# EAGLE design Signal_source_V1p0 (EAGLE 9.6.2)
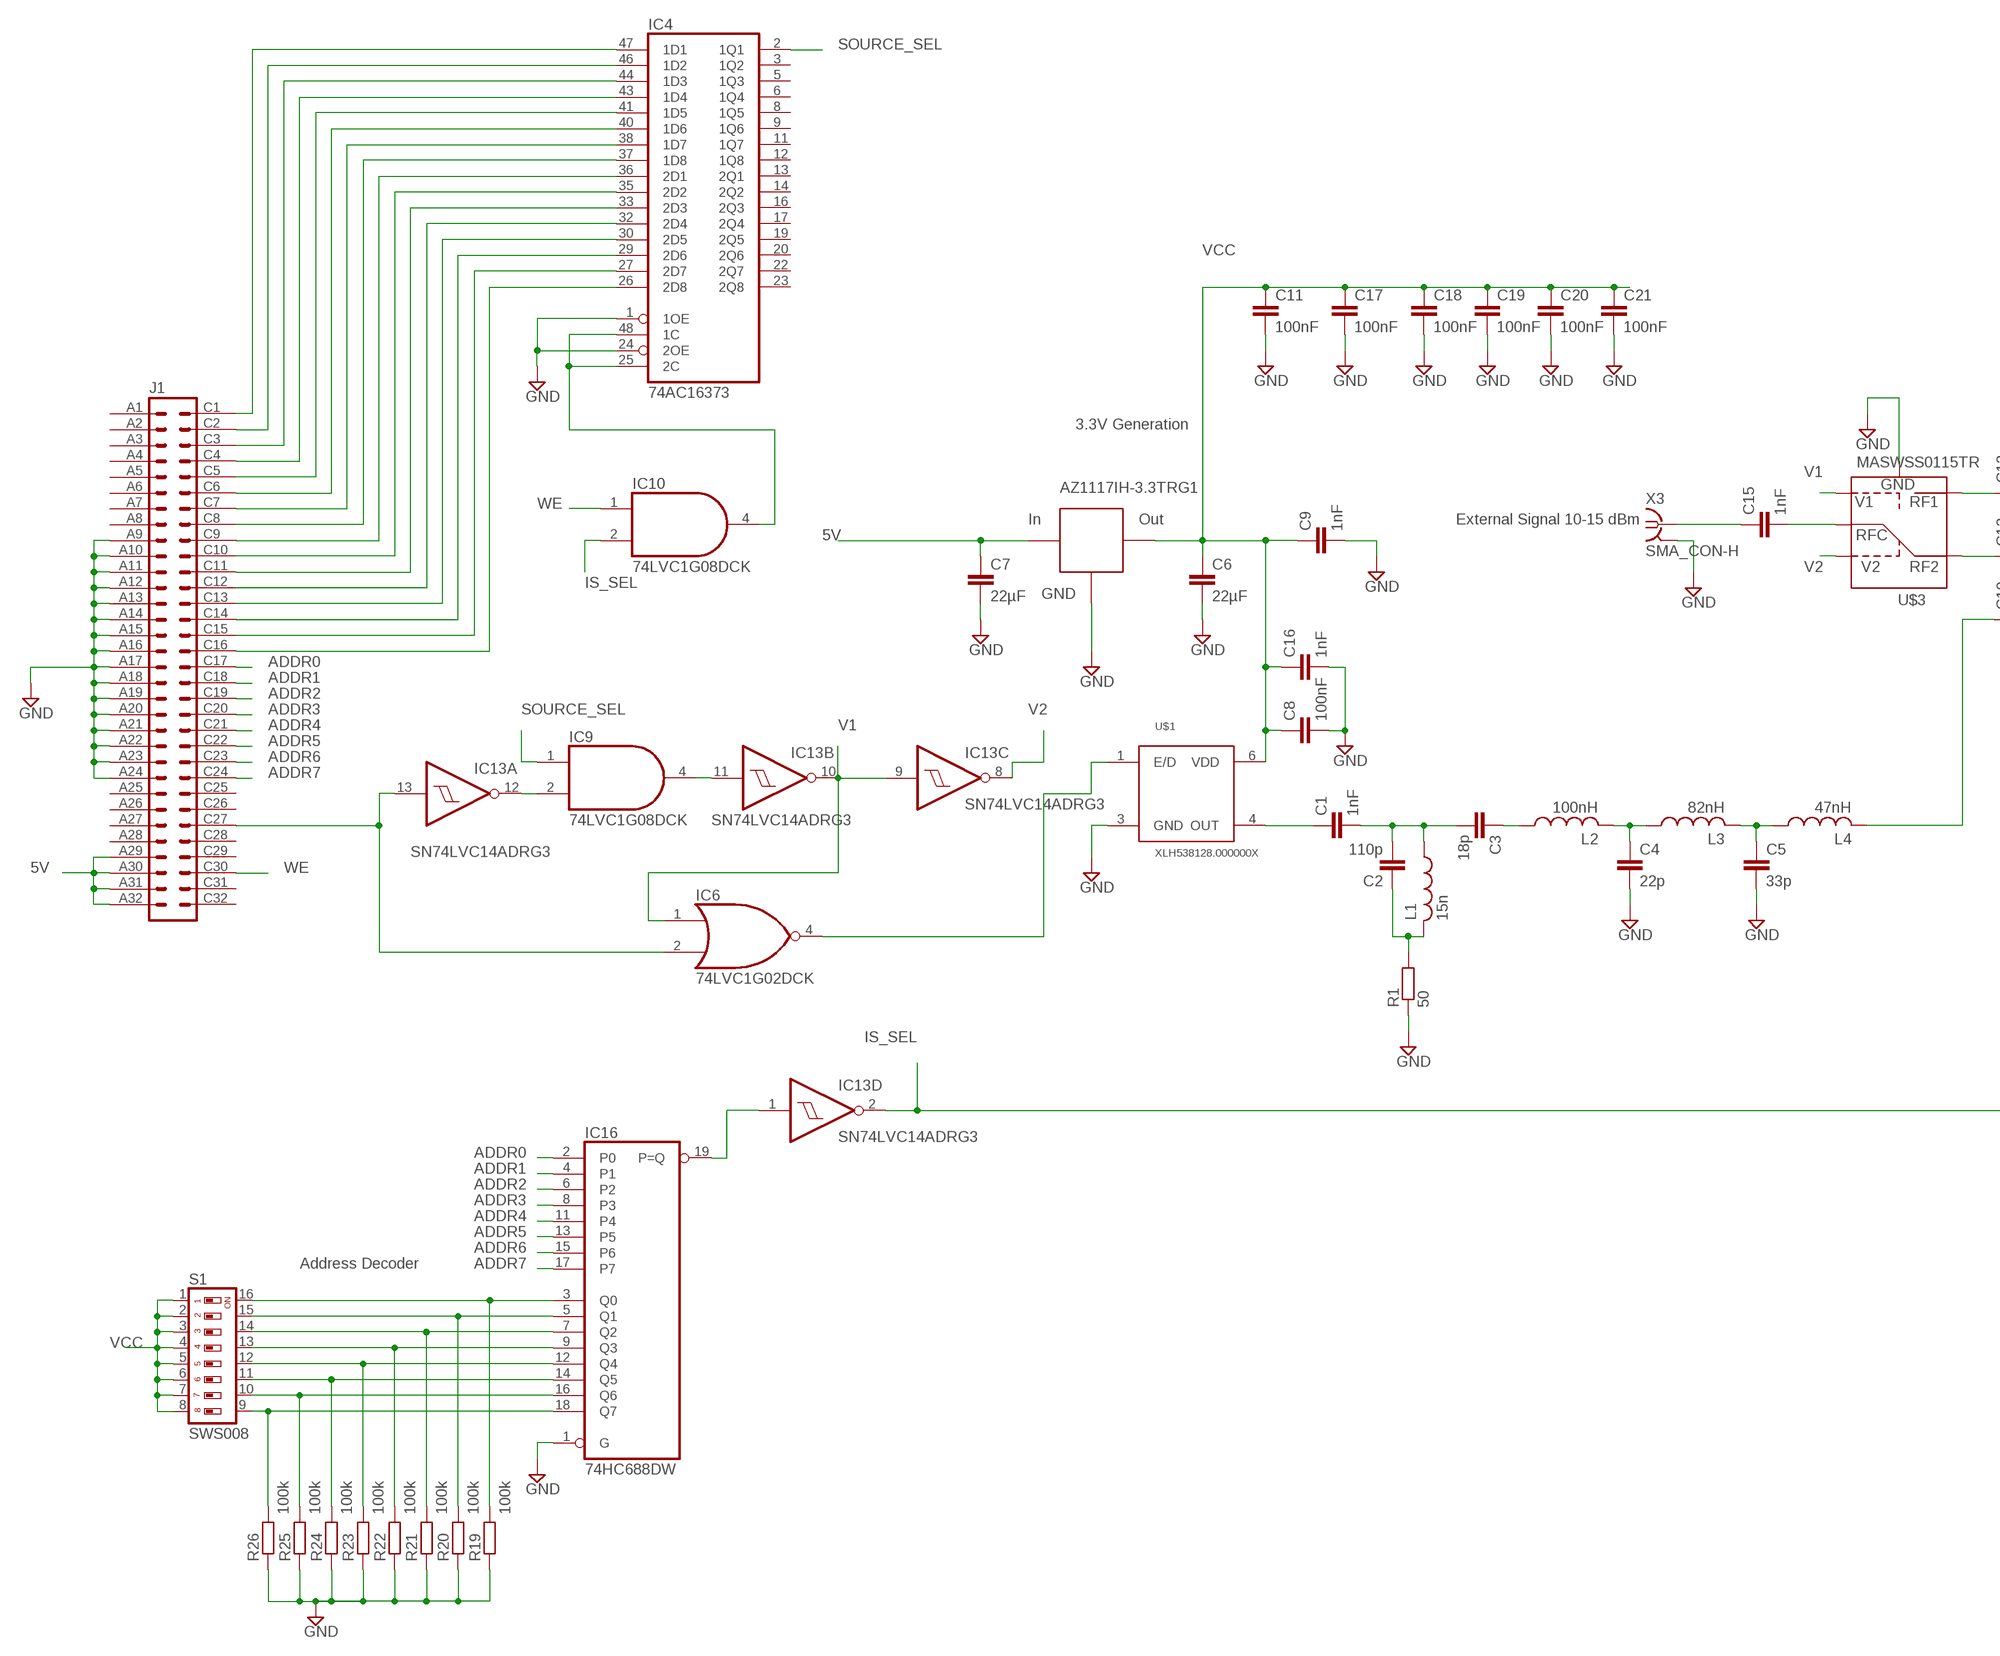
[diagram p0: schematic, sheet 1, part 1 of 2]
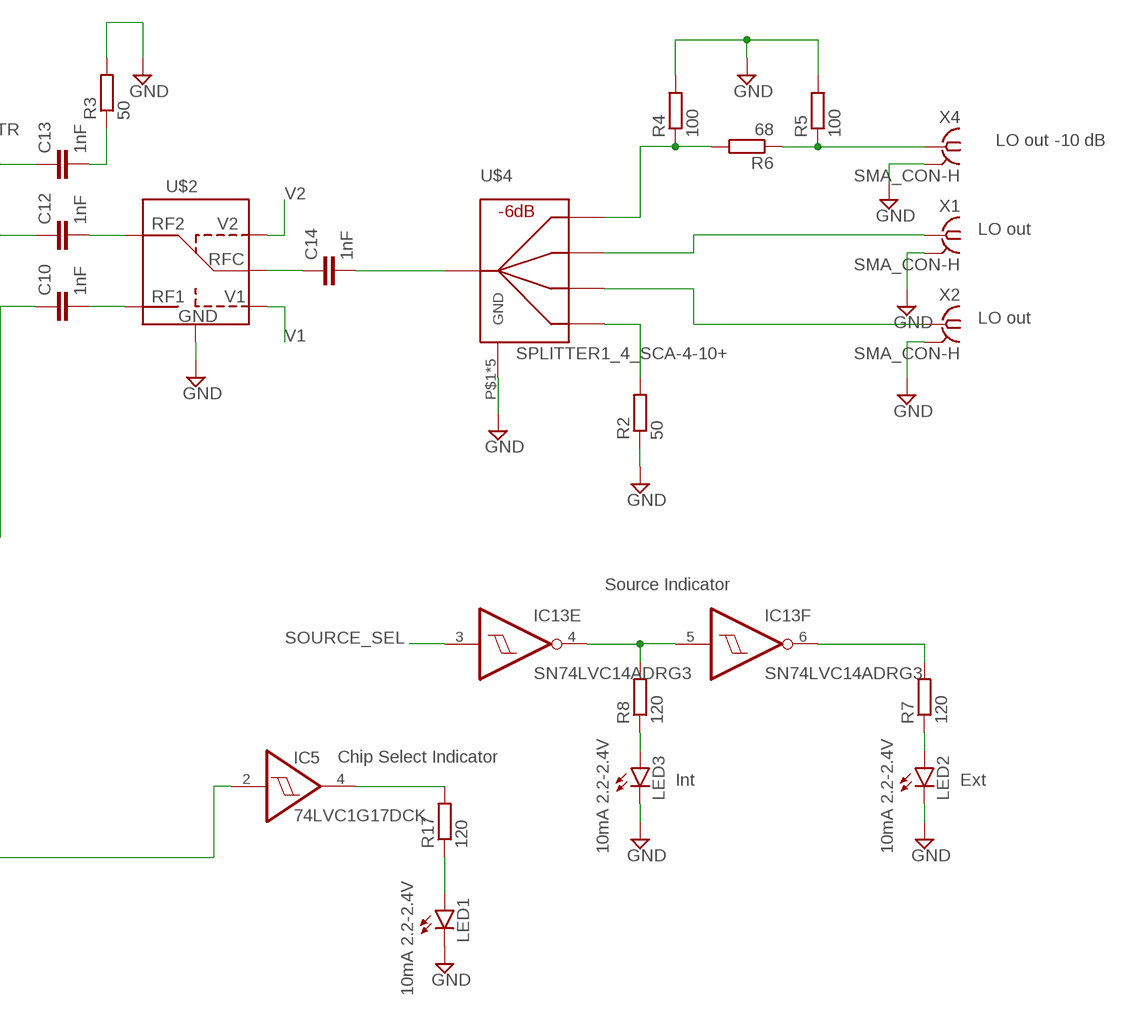
[diagram p1: schematic, sheet 1, part 2 of 2]

## Parts
C1  1nF  C-EUC0805  [C0805]
C2  110p  C-EUC0805  [C0805]
C3  18p  C-EUC0805  [C0805]
C4  22p  C-EUC0805  [C0805]
C5  33p  C-EUC0805  [C0805]
C6  22µF  C-EUC1206  [C1206]
C7  22µF  C-EUC1206  [C1206]
C8  100nF  C-EUC1206  [C1206]
C9  1nF  C-EUC0805  [C0805]
C10  1nF  C-EUC0805  [C0805]
C11  100nF  C-EUC1206  [C1206]
C12  1nF  C-EUC0805  [C0805]
C13  1nF  C-EUC0805  [C0805]
C14  1nF  C-EUC0805  [C0805]
C15  1nF  C-EUC0805  [C0805]
C16  1nF  C-EUC0805  [C0805]
C17  100nF  C-EUC1206  [C1206]
C18  100nF  C-EUC1206  [C1206]
C19  100nF  C-EUC1206  [C1206]
C20  100nF  C-EUC1206  [C1206]
C21  100nF  C-EUC1206  [C1206]
IC4  74AC16373  [SSOP48DL]
IC5  74LVC1G17DCK  [SC70-5]
IC6  74LVC1G02DCK  [SC70-5]
IC9  74LVC1G08DCK  [SC70-5]
IC10  74LVC1G08DCK  [SC70-5]
IC13  SN74LVC14ADRG3  7414D  [SO14]
IC16  74HC688DW  [SO20W]
J1  VG64P  [VG64P]
L1  15n  L-USL3225M  [L3225M]
L2  100nH  L-USL3225M  [L3225M]
L3  82nH  L-USL3225M  [L3225M]
L4  47nH  L-USL3225M  [L3225M]
LED1  10mA 2.2-2.4V  LED3MM  [LED3MM]
LED2  10mA 2.2-2.4V  LED3MM  [LED3MM]
LED3  10mA 2.2-2.4V  LED3MM  [LED3MM]
R1  50  R-EU_R0805  [R0805]
R2  50  R-EU_R0805  [R0805]
R3  50  R-EU_R0805  [R0805]
R4  100  R-EU_R0805  [R0805]
R5  100  R-EU_R0805  [R0805]
R6  68  R-EU_R0805  [R0805]
R7  120  R-EU_R0603  [R0603]
R8  120  R-EU_R0603  [R0603]
R17  120  R-EU_R0603  [R0603]
R19  100k  R-EU_R0603  [R0603]
R20  100k  R-EU_R0603  [R0603]
R21  100k  R-EU_R0603  [R0603]
R22  100k  R-EU_R0603  [R0603]
R23  100k  R-EU_R0603  [R0603]
R24  100k  R-EU_R0603  [R0603]
R25  100k  R-EU_R0603  [R0603]
R26  100k  R-EU_R0603  [R0603]
S1  SWS008  [SMS-008]
U$1  XLH538128.000000X  [5.0X3.2_XO]
U$2  MASWSS0115TR  SPDT_SC70-6  [SC70-6]
U$3  MASWSS0115TR  SPDT_SC70-6  [SC70-6]
U$4  SPLITTER1_4_SCA-4-10+  [SCA-4-10+]
U$9  AZ1117IH-3.3TRG1  LT1117  [SOT223]
X1  SMA_CON-H  [BU-SMA-H]
X2  SMA_CON-H  [BU-SMA-H]
X3  SMA_CON-H  [BU-SMA-H]
X4  SMA_CON-H  [BU-SMA-H]

## Nets
5V: C7.1 J1.A29 J1.A30 J1.A31 J1.A32 U$9.3(IN)
ADDR0: IC16.2(P0) J1.C17
ADDR1: IC16.4(P1) J1.C18
ADDR2: IC16.6(P2) J1.C19
ADDR3: IC16.8(P3) J1.C20
ADDR4: IC16.11(P4) J1.C21
ADDR5: IC16.13(P5) J1.C22
ADDR6: IC16.15(P6) J1.C23
ADDR7: IC16.17(P7) J1.C24
CLK_128: C1.1 U$1.4(OUT)
GND: C4.2 C5.2 C6.2 C7.2 C8.2 C9.2 C11.2 C16.2 C17.2 C18.2 C19.2 C20.2 C21.2 IC4.1(1OE) IC4.24(2OE) IC16.1(G) J1.A9 J1.A10 J1.A11 J1.A12 J1.A13 J1.A14 J1.A15 J1.A16 J1.A17 J1.A18 J1.A19 J1.A20 J1.A21 J1.A22 J1.A23 J1.A24 LED1.K(C) LED2.K(C) LED3.K(C) R1.1 R2.1 R3.2 R4.2 R5.2 R19.1 R20.1 R21.1 R22.1 R23.1 R24.1 R25.1 R26.1 U$1.3(GND) U$2.2(GND) U$3.2(GND) U$4.P$1(GND) U$4.P$2(GND) U$4.P$4(GND) U$4.P$5(GND) U$4.P$8(GND) U$9.1(GND) X1.2(GND) X1.3(GND) X1.4(GND) X1.5(GND) X2.2(GND) X2.3(GND) X2.4(GND) X2.5(GND) X3.2(GND) X3.3(GND) X3.4(GND) X3.5(GND) X4.2(GND) X4.3(GND) X4.4(GND) X4.5(GND)
IS_SEL: IC5.2(I) IC10.2(I1) IC13.2(D:O)
N$1: IC4.47(1D1) J1.C1
N$2 [RF_routing]: C1.2 C2.2 C3.2 L1.1
N$3 [RF_routing]: C2.1 L1.2 R1.2
N$4 [RF_routing]: C3.1 L2.1
N$5 [RF_routing]: C4.1 L2.2 L3.1
N$6 [RF_routing]: C5.1 L3.2 L4.1
N$7: IC4.46(1D2) J1.C2
N$8: IC4.44(1D3) J1.C3
N$9 [RF_routing]: C10.1 L4.2
N$10: IC4.43(1D4) J1.C4
N$11: IC4.41(1D5) J1.C5
N$12: IC4.40(1D6) J1.C6
N$13 [RF_routing]: C10.2 U$2.1(RF1)
N$14: IC4.38(1D7) J1.C7
N$15: IC4.37(1D8) J1.C8
N$16 [RF_routing]: C12.1 U$3.3(RF2)
N$17 [RF_routing]: C12.2 U$2.3(RF2)
N$18 [RF_routing]: C13.1 U$3.1(RF1)
N$19 [RF_routing]: C13.2 R3.1
N$20 [RF_routing]: C15.2 U$3.5(RFC)
N$21 [RF_routing]: C14.1 U$2.5(RFC)
N$22: C14.2 U$4.P$3
N$23 [RF_routing]: C15.1 X3.1
N$24: IC9.2(I1) IC13.12(A:O)
N$25: IC4.36(2D1) J1.C9
N$26: IC4.35(2D2) J1.C10
N$27: IC4.33(2D3) J1.C11
N$28: IC4.32(2D4) J1.C12
N$29: IC4.30(2D5) J1.C13
N$30: IC4.29(2D6) J1.C14
N$31: IC4.27(2D7) J1.C15
N$32: IC4.26(2D8) J1.C16
N$33: IC6.4(O) U$1.1(E/D)
N$34: IC6.2(I1) IC13.13(A:I) J1.C27
N$35: IC9.4(O) IC13.11(B:I)
N$36: IC4.25(2C) IC4.48(1C) IC10.4(O)
N$37: U$4.P$7 X1.1
N$38: U$4.P$9 X2.1
N$39: R2.2 U$4.P$10
N$40: IC16.3(Q0) R19.2 S1.16
N$41: R4.1 R6.2 U$4.P$6
N$42: R5.1 R6.1 X4.1
N$43: IC13.4(E:O) IC13.5(F:I) R8.2
N$44: IC13.6(F:O) R7.2
N$45: LED3.A R8.1
N$46: LED2.A R7.1
N$64: IC16.5(Q1) R20.2 S1.15
N$65: IC16.7(Q2) R21.2 S1.14
N$66: IC16.9(Q3) R22.2 S1.13
N$67: IC16.12(Q4) R23.2 S1.12
N$68: IC16.14(Q5) R24.2 S1.11
N$69: IC16.16(Q6) R25.2 S1.10
N$70: IC16.18(Q7) R26.2 S1.9
N$80: IC13.1(D:I) IC16.19(P=Q)
N$88: LED1.A R17.1
N$89: IC5.4(O) R17.2
SOURCE_SEL: IC4.2(1Q1) IC9.1(I0) IC13.3(E:I)
V1: IC6.1(I0) IC13.9(C:I) IC13.10(B:O) U$2.6(V1) U$3.6(V1)
V2: IC13.8(C:O) U$2.4(V2) U$3.4(V2)
VCC [3.3V]: C6.1 C8.1 C9.1 C11.1 C16.1 C17.1 C18.1 C19.1 C20.1 C21.1 S1.1 S1.2 S1.3 S1.4 S1.5 S1.6 S1.7 S1.8 U$1.6(VDD) U$9.2(OUT) U$9.4(OUT)
WE: IC10.1(I0) J1.C30
Unconnected: IC4.3(1Q2) IC4.5(1Q3) IC4.6(1Q4) IC4.8(1Q5) IC4.9(1Q6) IC4.11(1Q7) IC4.12(1Q8) IC4.13(2Q1) IC4.14(2Q2) IC4.16(2Q3) IC4.17(2Q4) IC4.19(2Q5) IC4.20(2Q6) IC4.22(2Q7) IC4.23(2Q8) J1.A1 J1.A2 J1.A3 J1.A4 J1.A5 J1.A6 J1.A7 J1.A8 J1.A25 J1.A26 J1.A27 J1.A28 J1.C25 J1.C26 J1.C28 J1.C29 J1.C31 J1.C32

## Notes on the sheet
- 3.3V Generation
- LO out -10 dB
- External Signal 10-15 dBm
- LO out
- LO out
- Source Indicator
- Chip Select Indicator
- Int | Ext
- Address Decoder

## Power pins joined to a net without a drawn wire
GND: IC4.4(GND) IC4.10(GND) IC4.15(GND) IC4.21(GND) IC4.28(GND) IC4.34(GND) IC4.39(GND) IC4.45(GND) IC5.3(GND) IC6.3(GND) IC9.3(GND) IC10.3(GND) IC13.7(P:GND) IC16.10(GND)
VCC: IC4.7(VCC) IC4.18(VCC) IC4.31(VCC) IC4.42(VCC) IC5.5(VCC) IC6.5(VCC) IC9.5(VCC) IC10.5(VCC) IC13.14(P:VCC) IC16.20(VCC)

## Library data of the parts
C1-C21 = rcl:C-EU: CAPACITOR, European symbol; SPICEPREFIX: C
IC4 = 74ac-logic:74AC16373: 16-bit transparent D-type LATCH, 3-state
IC5 = 74xx-little-de:74*1G17: Single Schmitt-Trigger Buffer
IC6 = 74xx-little-us:74*1G02: 2-input NOR gate
IC9 IC10 = 74xx-little-us:74*1G08: 2-input AND gate
IC13 = 74xx-us:74*14: Hex schmitt trigger INVERTER
IC16 = 74xx-eu:74*688: 8-bit MAGNITUDE/IDENTITY COMPARATOR, totem pole
J1 = 19inch:VG64: PCB EUROCARD, 64-pin type C/AC, 2.54 mm
L1-L4 = rcl:L-US: INDUCTOR, American symbol; SPICEPREFIX: L
LED1-LED3 = led:LED: LED OSRAM: - CHIPLED LG R971, LG N971, LY N971, LG Q971, LY Q971, LO R971, LY R971 LH N974, LH R974 LS Q976, LO Q976, LY Q976 LO Q996 - Hyper CHIPLED LW Q18S LB Q993, LB Q99A, LB R99A - SideLED LS A670, LO A670, LY A670, LG A670, LP A670 LB A673, LV A673, LT A673, LW A673 LH A674 LY A675 LS A676, LA A676, LO A676, LY A676, LW A676 LS A679, LY A679, LG A679 - Hyper Micro SIDELED® LS Y876, LA Y876, LO Y876, LY Y876 LT Y87S - SmartLED LW L88C, LW L88S LB L89C, LB L89S, LG L890 LS L89K, LO L89K, LY L89K LS L896, LA L896, LO L896, LY L896 - TOPLED LS T670, LO T670, LY T670, LG T670, LP T670 LSG T670, LSP T670, LSY T670, LOP T670, LYG T670 LG T671, LOG T671, LSG T671 LB T673, LV T673, LT T673, LW T673 LH T674 LS T676, LA T676, LO T676, LY T676, LB T676, LH T676, LSB T676, LW T676 LB T67C, LV T67C, LT T67C, LS T67K, LO T67K, LY T67K, LW E67C LS E67B, LA E67B, LO E67B, LY E67B, LB E67C, LV E67C, LT E67C LW T67C LS T679, LY T679, LG T679 LS T770, LO T770, LY T770, LG T770, LP T770 LB T773, LV T773, LT T773, LW T773 LH T774 LS E675, LA E675, LY E675, LS T675 LS T776, LA T776, LO T776, LY T776, LB T776 LHGB T686 LT T68C, LB T68C - Hyper Mini TOPLED® LB M676 - Mini TOPLED Santana® LG M470 LS M47K, LO M47K, LY M47K Source: http://www.osram.convergy.de LUXEON: - LUMILED® LXK2-PW12-R00, LXK2-PW12-S00, LXK2-PW14-U00, LXK2-PW14-V00 LXK2-PM12-R00, LXK2-PM12-S00, LXK2-PM14-U00 LXK2-PE12-Q00, LXK2-PE12-R00, LXK2-PE12-S00, LXK2-PE14-T00, LXK2-PE14-U00 LXK2-PB12-K00, LXK2-PB12-L00, LXK2-PB12-M00, LXK2-PB14-N00, LXK2-PB14-P00, LXK2-PB14-Q00 LXK2-PR12-L00, LXK2-PR12-M00, LXK2-PR14-Q00, LXK2-PR14-R00 LXK2-PD12-Q00, LXK2-PD12-R00, LXK2-PD12-S00 LXK2-PH12-R00, LXK2-PH12-S00 LXK2-PL12-P00, LXK2-PL12-Q00, LXK2-PL12-R00 Source: www.luxeon.com KINGBRIGHT: KA-3528ASYC Source: www.kingbright.com
R1-R8 R17 R19-R26 = rcl:R-EU_: RESISTOR, European symbol; SPICEPREFIX: R
S1 = smd-special:SWS008: SMD Dip Switch 8 pol.
U$1 = Orzada:XLH538128.000000X
U$2 U$3 = Orzada:SPDT
U$4 = Orzada:SPLITTER1_4: 1:4 Splitter Minicircuits
U$9 = Orzada:LT1117
X1-X4 = Orzada:SMA_CON

## Net classes
2 3.3V: width 0.254 mm

## Board
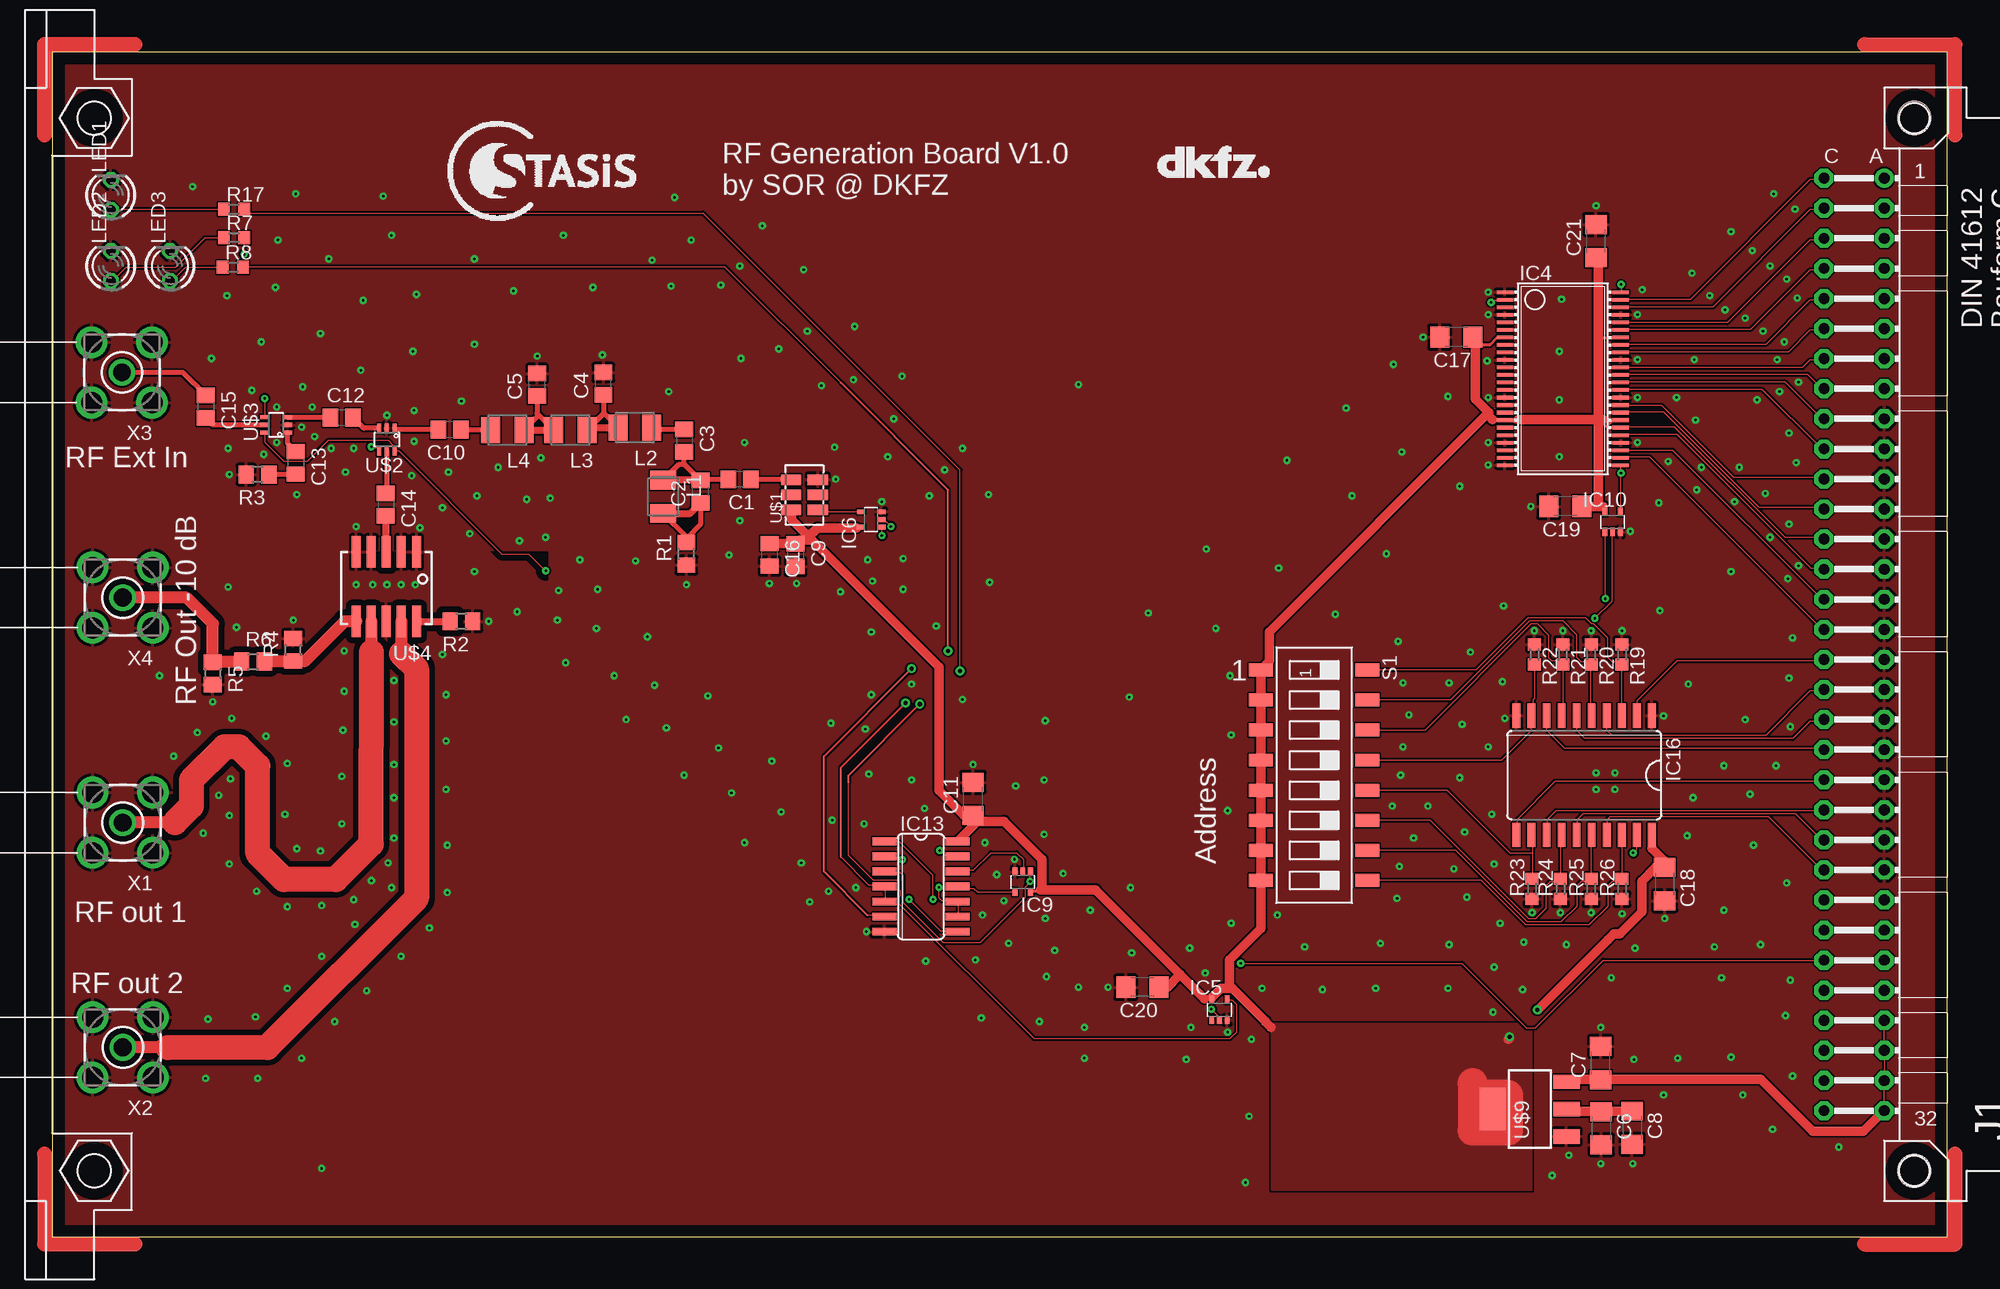
[diagram p2: board, top side]
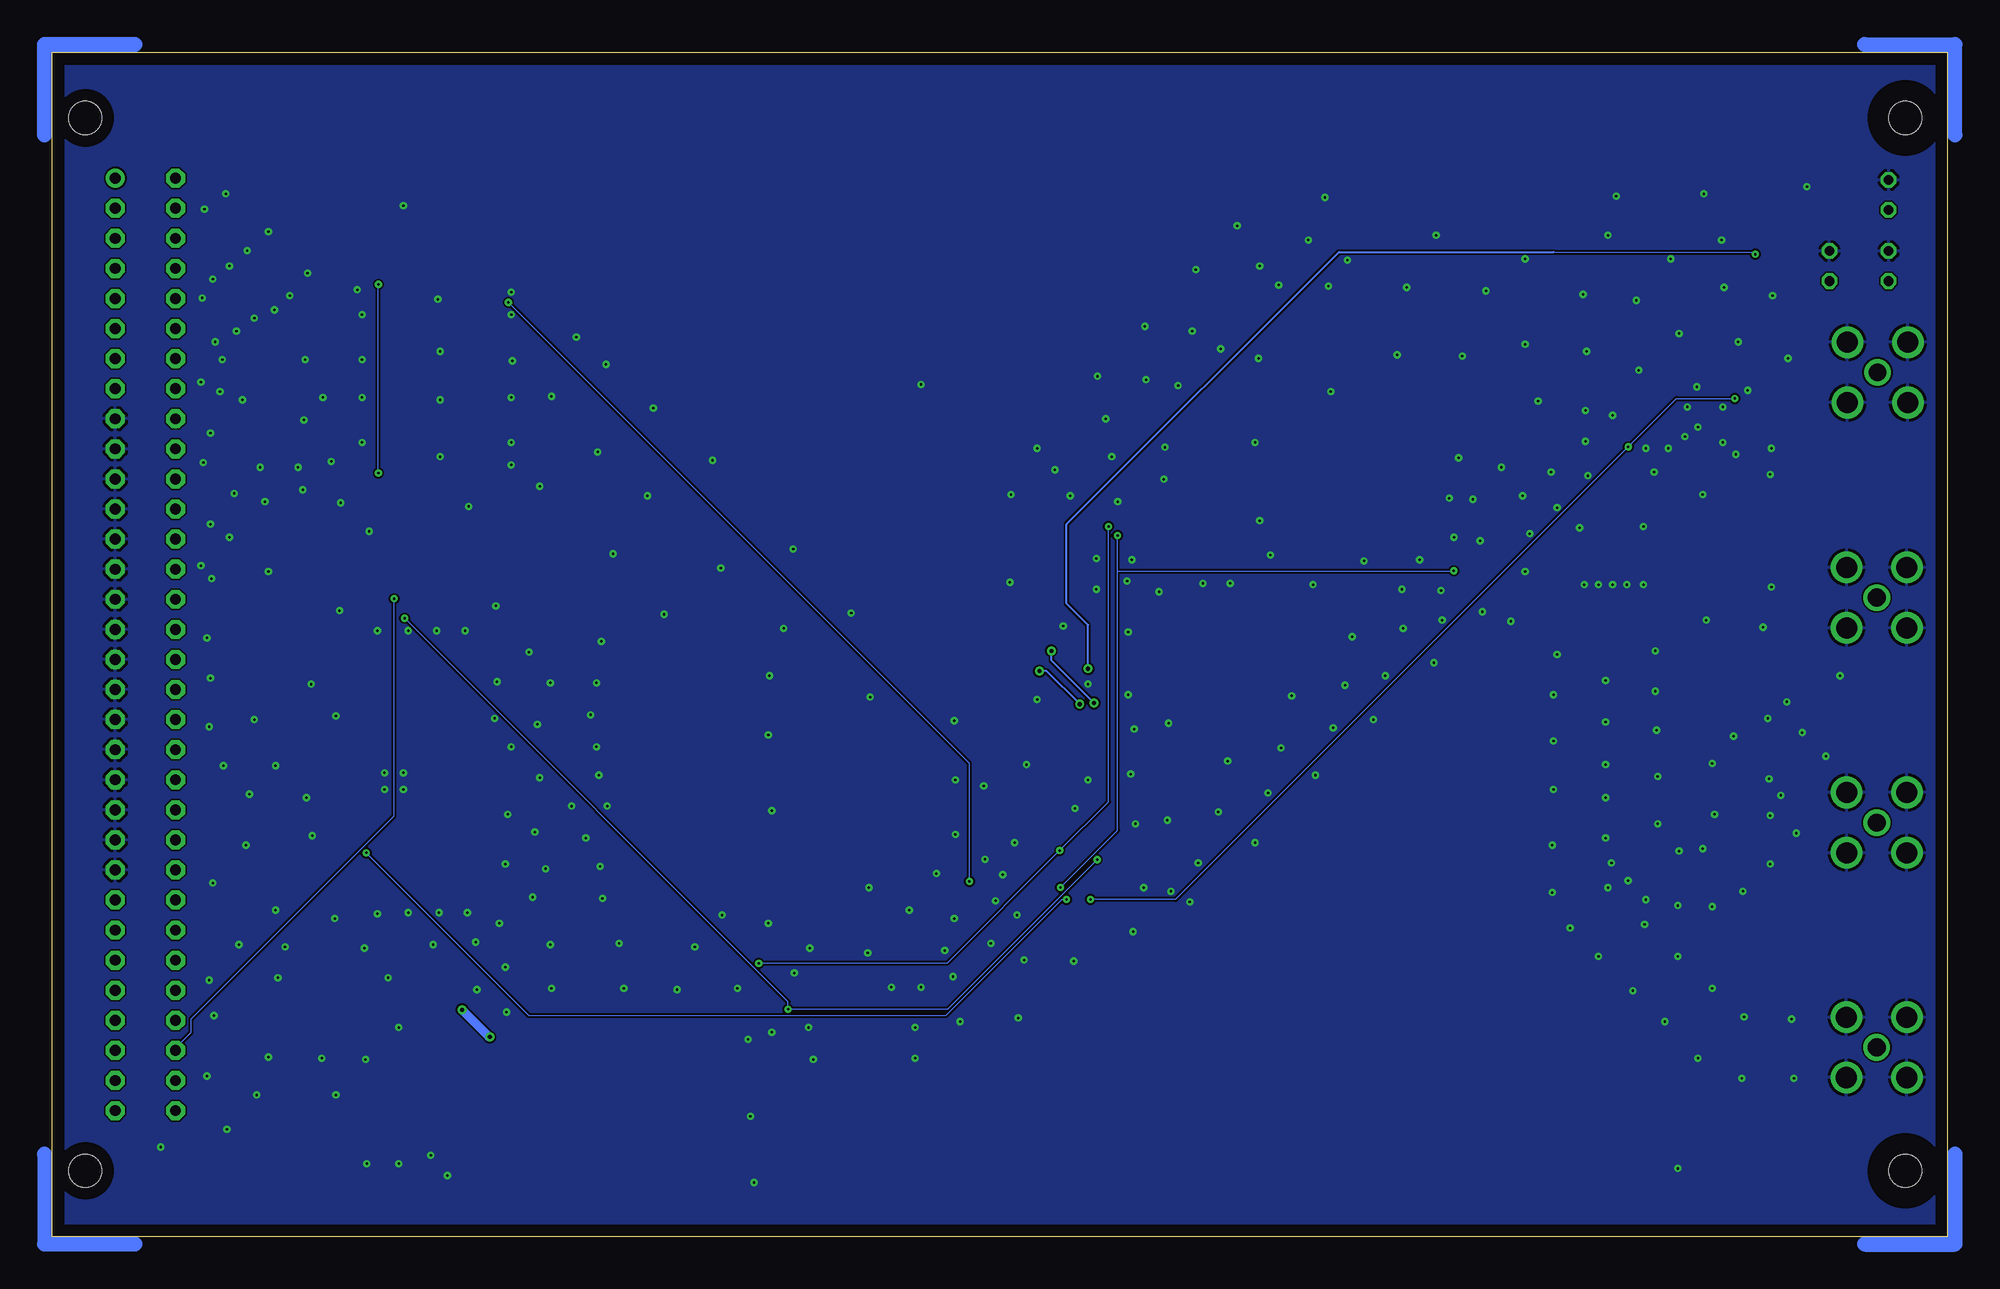
[diagram p3: board, bottom side, seen from below]

Size 160.02 x 100.03 mm. Coordinates in mm from the lower left corner, seen from the top.
Copper layers (1*16): Top 0.035mm / dielectric 1.5mm / Bottom 0.035mm
Design rules "default *": minimum track width 4mil, minimum drill 0.2mm, track to track 6mil, track to pad 6mil, pad to pad 6mil, via to via 6mil, smd to smd 6mil, copper to edge 40mil, drill to drill 6mil, minimum pad ring 10mil, minimum via ring 8mil, stop-mask expansion 4mil, vias tented up to drill 0mil, thermal gap 10mil

### Footprints (pad centres in the part's own frame; a part is rotated, then mirrored left to right if it is on the bottom)
C0805 = smd 1.3 x 1.5: 1 -0.95,0; 2 0.95,0
C1206 = smd 1.6 x 1.8: 1 -1.4,0; 2 1.4,0
SSOP48DL = smd 0.305 x 1.422: 1 -6.985,-4.877; 2 -6.35,-4.877; 3 -5.715,-4.877; 4 -5.08,-4.877; 5 -4.445,-4.877; 6 -3.81,-4.877; 7 -3.175,-4.877; 8 -2.54,-4.877; 9 -1.905,-4.877; 10 -1.27,-4.877; 11 -0.635,-4.877; 12 0,-4.877; 13 0.635,-4.877; 14 1.27,-4.877; 15 1.905,-4.877; 16 2.54,-4.877; 17 3.175,-4.877; 18 3.81,-4.877; 19 4.445,-4.877; 20 5.08,-4.877; 21 5.715,-4.877; 22 6.35,-4.877; 23 6.985,-4.877; 24 7.62,-4.877; 25 7.62,4.877; 26 6.985,4.877; 27 6.35,4.877; 28 5.715,4.877; 29 5.08,4.877; 30 4.445,4.877; 31 3.81,4.877; 32 3.175,4.877; 33 2.54,4.877; 34 1.905,4.877; 35 1.27,4.877; 36 0.635,4.877; 37 0,4.877; 38 -0.635,4.877; 39 -1.27,4.877; 40 -1.905,4.877; 41 -2.54,4.877; 42 -3.175,4.877; 43 -3.81,4.877; 44 -4.445,4.877; 45 -5.08,4.877; 46 -5.715,4.877; 47 -6.35,4.877; 48 -6.985,4.877
SC70-5 = smd 0.4 x 0.7: 1 -0.65,-0.85; 2 0,-0.85; 3 0.65,-0.85; 4 0.65,0.85; 5 -0.65,0.85
SO14 = smd 0.66 x 2.032: 1 -3.81,-3.073; 2 -2.54,-3.073; 3 -1.27,-3.073; 4 0,-3.073; 5 1.27,-3.073; 6 2.54,-3.073; 7 3.81,-3.073; 8 3.81,3.073; 9 2.54,3.073; 10 1.27,3.073; 11 0,3.073; 12 -1.27,3.073; 13 -2.54,3.073; 14 -3.81,3.073
SO20W = smd 0.66 x 2.032: 1 -5.715,-5.029; 2 -4.445,-5.029; 3 -3.175,-5.029; 4 -1.905,-5.029; 5 -0.635,-5.029; 6 0.635,-5.029; 7 1.905,-5.029; 8 3.175,-5.029; 9 4.445,-5.029; 10 5.715,-5.029; 11 5.715,5.029; 12 4.445,5.029; 13 3.175,5.029; 14 1.905,5.029; 15 0.635,5.029; 16 -0.635,5.029; 17 -1.905,5.029; 18 -3.175,5.029; 19 -4.445,5.029; 20 -5.715,5.029
VG64P = drill 0.914 pad 1.6: A1 154.94,39.37 | drill 0.914 pad 1.6 octagon: A2 154.94,36.83; A3 154.94,34.29; A4 154.94,31.75; A5 154.94,29.21; A6 154.94,26.67; A7 154.94,24.13; A8 154.94,21.59; A9 154.94,19.05; A10 154.94,16.51; A11 154.94,13.97; A12 154.94,11.43; A13 154.94,8.89; A14 154.94,6.35; A15 154.94,3.81; A16 154.94,1.27; A17 154.94,-1.27; A18 154.94,-3.81; A19 154.94,-6.35; A20 154.94,-8.89; A21 154.94,-11.43; A22 154.94,-13.97; A23 154.94,-16.51; A24 154.94,-19.05; A25 154.94,-21.59; A26 154.94,-24.13; A27 154.94,-26.67; A28 154.94,-29.21; A29 154.94,-31.75; A30 154.94,-34.29; A31 154.94,-36.83; A32 154.94,-39.37; C1 149.86,39.37; C2 149.86,36.83; C3 149.86,34.29; C4 149.86,31.75; C5 149.86,29.21; C6 149.86,26.67; C7 149.86,24.13; C8 149.86,21.59; C9 149.86,19.05; C10 149.86,16.51; C11 149.86,13.97; C12 149.86,11.43; C13 149.86,8.89; C14 149.86,6.35; C15 149.86,3.81; C16 149.86,1.27; C17 149.86,-1.27; C18 149.86,-3.81; C19 149.86,-6.35; C20 149.86,-8.89; C21 149.86,-11.43; C22 149.86,-13.97; C23 149.86,-16.51; C24 149.86,-19.05; C25 149.86,-21.59; C26 149.86,-24.13; C27 149.86,-26.67; C28 149.86,-29.21; C29 149.86,-31.75; C30 149.86,-34.29; C31 149.86,-36.83; C32 149.86,-39.37 | hole 2.794: 3.81,44.45; 3.81,-44.45; 157.48,44.45; 157.48,-44.45
L3225M = smd 1.6 x 2.2: 1 -1.4,0; 2 1.4,0
LED3MM = drill 0.813 octagon: A -1.27,0; K 1.27,0
R0805 = smd 1.3 x 1.5: 1 -0.95,0; 2 0.95,0
R0603 = smd 1 x 1.1: 1 -0.85,0; 2 0.85,0
SMS-008 = smd 1.092 x 2.007: 1 -8.89,-4.496; 2 -6.35,-4.496; 3 -3.81,-4.496; 4 -1.27,-4.496; 5 1.27,-4.496; 6 3.81,-4.496; 7 6.35,-4.496; 8 8.89,-4.496; 9 8.89,4.496; 10 6.35,4.496; 11 3.81,4.496; 12 1.27,4.496; 13 -1.27,4.496; 14 -3.81,4.496; 15 -6.35,4.496; 16 -8.89,4.496
5.0X3.2_XO = smd 0.89 x 1.71: 1 -1.27,-1.135; 2 0,-1.135; 3 1.27,-1.135; 4 1.27,1.135; 5 0,1.135; 6 -1.27,1.135
SC70-6 = smd 0.35 x 0.8: 1 -0.65,-0.95; 2 0,-0.95; 3 0.65,-0.95; 4 0.65,0.95; 5 0,0.95; 6 -0.65,0.95
SCA-4-10+ = smd 0.762 x 2.667: P$1 0,-0.254; P$2 1.27,-0.254; P$3 2.54,-0.254; P$4 3.81,-0.254; P$5 5.08,-0.254; P$6 5.08,5.613; P$7 3.81,5.613; P$8 2.54,5.613; P$9 1.27,5.613; P$10 0,5.613
SOT223 = smd 1.219 x 2.235: 1 -2.311,-3.099; 2 0,-3.099; 3 2.311,-3.099 | smd 3.6 x 2.2: 4 0,3.099
BU-SMA-H = drill 1.5: 1 0,0 | drill 1.778: 2 -2.55,2.55; 3 2.55,2.55; 4 2.55,-2.55; 5 -2.55,-2.55

### Placement (x,y rotation side)
C1  58.06,63.95 180 top
C2  54.75,62.9 90 top
C3  53.37,67.22 270 top
C4  46.55,72.02 90 top
C5  40.95,71.94 90 top
C6  130.8,9.15 270 top
C7  130.75,14.65 90 top
C8  133.4,9.2 270 top
C9  62.77,57.54 270 top
C10  33.58,68.15 180 top
C11  77.76,36.96 90 top
C12  24.46,69.17 0 top
C13  20.57,65.34 270 top
C14  28.17,61.82 270 top
C15  12.97,70.1 270 top
C16  60.57,57.58 270 top
C17  118.56,75.96 180 top
C18  136.16,29.76 270 top
C19  127.76,61.66 180 top
C20  92.06,21.06 180 top
C21  130.36,84.06 90 top
IC4  127.56,72.76 270 top
IC5  98.56,19.16 0 top
IC6  69.16,60.56 90 top
IC9  81.96,29.96 180 top
IC10  131.76,60.36 0 top
IC13  73.36,29.56 270 top
IC16  129.36,38.96 180 top
J1  -0.25,50.01 0 top
L1  51.6,62.48 270 top
L2  49.2,68.32 180 top
L3  43.76,68.12 180 top
L4  38.44,68.12 180 top
LED1  4.96,87.96 90 top
LED2  4.96,81.96 90 top
LED3  9.96,81.96 90 top
R1  53.55,57.66 90 top
R2  34.56,51.96 180 top
R3  17.34,64.35 180 top
R4  20.36,49.56 90 top
R5  13.56,47.56 270 top
R6  16.96,48.56 0 top
R7  15.36,84.36 0 top
R8  15.26,81.86 0 top
R17  15.36,86.76 0 top
R19  132.56,49.16 270 top
R20  129.96,49.16 270 top
R21  127.56,49.16 270 top
R22  125.16,49.16 270 top
R23  124.96,29.36 90 top
R24  127.36,29.36 90 top
R25  129.96,29.36 90 top
R26  132.56,29.36 90 top
S1  106.56,38.96 270 top
U$1  63.52,62.64 90 top
U$2  28.26,67.32 180 top
U$3  18.92,68.55 90 top
U$4  30.76,57.56 180 top
U$5  [LOGO_STASIS]  42.36,89.76 0 top
U$6  [LOGO_DKFZ]  93.36,89.36 0 top
U$9  124.76,10.76 90 top
X1  5.96,34.96 180 top
X2  5.97,15.98 180 top
X3  5.89,72.98 180 top
X4  5.96,53.96 180 top

### Tracks (layer width: path | path; a pad name or v marks a point on that pad's centre or on a via)
5V
  Top 0.102: J1.A29 154.71,18.25 154.71,15.77 J1.A30 154.71,15.71 154.71,13.23 J1.A31 154.71,13.17 154.71,10.69 J1.A32 154.64,10.63 | 128.1,13.04 128.35,13.3 | 130.7,13.3 C7.1 130.77,13.3
  Top 0.152: U$9.3 128.13,13.07 128.35,13.3
  Top 0.813: 128.35,13.3 130.7,13.3 | 130.77,13.3 144.25,13.3 148.65,8.9 152.91,8.9 154.64,10.63
ADDR0
  Top 0.102: IC16.2 133.81,44.03 133.81,45.24 137.18,48.6 149.44,48.6 149.56,48.73 J1.C17
ADDR1
  Top 0.102: IC16.4 131.27,43.97 131.27,42.76 131.72,42.32 144.67,42.32 148.42,46.06 149.44,46.06 149.56,46.19 J1.C18
ADDR2
  Top 0.102: IC16.6 128.73,43.97 128.73,42.76 129.43,42.06 146.96,42.06 148.42,43.52 149.44,43.52 149.56,43.65 J1.C19
ADDR3
  Top 0.102: IC16.8 126.19,43.97 126.19,42.76 127.72,41.24 149.5,41.24 149.56,41.17 J1.C20
ADDR4
  Top 0.102: IC16.11 123.65,35.2 126.89,38.44 149.44,38.44 149.56,38.57 J1.C21
ADDR5
  Top 0.102: IC16.13 126.19,35.2 126.96,35.97 149.5,35.97 149.56,36.03 J1.C22
ADDR6
  Top 0.102: IC16.15 128.73,35.2 129.24,35.71 147.21,35.71 149.37,33.55 149.56,33.55 J1.C23
ADDR7
  Top 0.102: IC16.17 131.27,35.2 131.53,35.46 144.93,35.46 149.37,31.01 149.56,31.01 J1.C24
CLK_128
  Top 0.406: U$1.4 59.05,63.91 C1.1
GND  (via drill 0.2)
  other vias: 68.76,25.76 22.76,5.76 28.86,46.96 28.86,43.46 28.86,39.86 28.86,37.06 28.86,33.66 28.36,31.56 26.96,30.06 25.46,28.46 22.76,27.96 19.86,27.86 17.26,29.16 14.96,31.46 14.96,35.56 15.06,38.66 14.06,37.26 12.76,34.06 28.66,29.46 25.56,26.36 22.76,23.66 19.86,20.96 17.16,18.56 13.16,18.36 12.96,13.36 17.36,13.36 21.06,15.06 23.86,18.16 26.56,20.76 29.46,23.66 31.86,26.06 33.36,29.06 33.36,33.06 33.26,37.76 33.26,41.86 33.26,45.76 32.96,49.16 24.66,49.46 24.66,46.06 24.56,42.76 24.46,38.86 24.46,34.86 22.66,32.56 20.66,32.76 19.66,35.66 19.86,39.96 18.06,42.26 15.16,43.76 12.26,42.56 10.26,40.56 13.56,45.16 20.36,52.06 36.86,51.96 40.96,74.36 46.46,74.46 28.26,69.36 14.96,64.36 70.06,62.06 66.16,63.96 60.56,55.16 62.86,55.16 77.76,39.86 81.26,31.86 99.26,17.26 128.06,6.86 130.76,6.16 133.46,6.16 130.76,17.66 136.16,26.86 132.56,27.26 129.96,27.36 127.36,27.36 124.96,27.36 136.06,43.96 132.56,51.16 129.96,51.16 127.56,51.16 125.16,51.16 133.26,59.56 133.86,67.06 133.86,70.86 133.86,74.06 133.86,77.86 115.76,75.96 121.26,77.86 121.26,79.76 121.16,73.96 121.26,70.86 121.26,67.06 121.26,65.16 124.86,61.66 89.16,21.06 31.06,59.86 25.66,59.96 21.06,68.36 22.16,67.56 23.56,66.56 25.46,66.56 20.66,62.66 24.76,64.56 30.36,64.26 32.96,61.56 35.26,59.36 35.66,56.16 39.26,52.76 42.66,52.06 43.36,48.46 47.46,47.36 48.46,43.66 51.86,42.96 53.36,38.96 57.36,37.46 58.46,33.26 63.26,31.56 63.96,28.26 65.56,29.16 67.86,29.46 61.56,35.86 56.26,41.26 50.86,46.56 45.96,51.36 42.76,54.56 46.06,54.66 50.26,50.66 55.36,45.66 60.76,40.16 65.86,35.16 41.66,59.06 39.46,58.76 35.86,62.56 33.46,64.56 40.06,62.26 37.66,64.96 41.26,65.76 42.06,62.36 44.56,57.16 49.26,57.06 53.56,55.06 57.16,57.56 58.06,60.46 66.56,54.46 69.16,51.06 69.16,45.76 68.96,39.06 68.56,34.86 73.66,36.16 72.56,38.56 72.56,46.66 76.86,45.36 74.66,51.56 69.26,55.36 68.86,57.16 71.86,57.26 71.86,54.66 58.46,67.06 52.06,71.36 34.56,70.56 30.46,74.76 26.26,79.06 23.36,82.56 19.06,84.16 18.86,80.16 22.66,76.26 26.06,73.16 30.56,69.76 21.16,71.76 17.66,75.56 14.76,79.46 13.46,74.16 16.86,71.46 21.96,70.06 18.96,70.06 30.56,67.16 18.96,67.06 17.86,66.06 14.86,66.56 73.76,23.26 78.46,18.46 87.16,15.06 95.76,14.96 101.26,16.66 96.16,17.66 87.16,17.66 83.36,18.16 77.96,23.36 80.76,24.76 78.56,27.16 83.96,21.96 86.66,21.06 84.66,24.16 91.16,23.96 87.66,27.56 83.86,26.86 80.36,28.36 79.76,30.56 78.76,33.26 83.76,33.96 85.36,30.66 91.06,29.46 96.06,24.36 97.36,22.26 99.56,26.46 83.76,38.56 81.36,38.06 83.86,43.56 90.96,45.56 92.56,52.66 98.26,51.36 103.56,56.46 109.76,62.56 113.96,66.26 117.86,70.96 118.86,63.36 112.66,57.66 108.36,52.56 97.46,58.06 104.26,65.56 109.26,69.96 113.26,73.66 117.96,46.76 114.06,46.76 114.56,44.06 114.06,41.36 113.86,38.96 113.16,36.36 116.16,36.36 118.86,38.76 121.26,41.36 119.06,43.26 122.46,46.86 114.96,33.66 118.36,31.06 113.76,31.26 113.56,28.56 119.46,28.66 119.26,34.16 121.76,31.46 122.26,26.46 124.26,24.86 127.86,24.66 124.16,20.86 117.86,20.96 111.76,20.96 107.26,20.86 102.16,20.96 121.76,22.76 117.96,24.66 112.16,24.76 105.76,24.46 103.46,27.16 99.26,35.96 99.56,42.36 99.46,47.36 119.76,49.36 113.66,50.26 122.56,53.26 138.16,46.66 146.66,47.16 146.76,43.06 142.96,43.66 145.56,39.76 141.16,39.76 143.36,37.36 138.56,37.06 121.56,35.66 138.06,33.86 143.66,33.06 146.46,29.86 144.26,24.66 141.16,27.56 140.36,24.46 133.66,24.36 131.66,21.86 140.96,21.86 146.76,21.66 146.36,18.66 146.96,13.56 141.76,15.16 137.26,15.06 133.56,14.96 136.06,11.96 142.76,11.96 145.26,9.06 150.86,7.56 126.66,5.16 100.76,4.56 101.06,10.16 121.66,18.96 146.96,50.56 135.66,61.96 135.76,52.86 141.76,56.16 146.56,55.56 138.86,63.06 139.26,64.96 142.06,62.06 145.06,59.06 147.46,56.66 136.46,65.46 144.66,62.76 146.66,60.16 142.46,64.96 138.76,68.96 137.16,70.86 143.96,70.66 146.66,67.86 147.26,65.36 145.86,71.36 147.46,72.16 138.66,74.06 145.66,74.06 146.26,75.56 144.46,76.46 142.96,77.56 141.26,78.26 139.96,79.46 145.06,81.96 146.46,80.86 143.56,83.26 147.36,79.26 147.16,86.76 134.26,79.96 138.46,81.36 141.76,84.86 145.36,88.06 86.66,71.96 61.36,74.96 35.66,75.36 30.76,79.56 35.66,82.56 20.56,88.06 11.86,88.66 14.86,54.86 9.06,47.36 15.56,51.46 127.26,65.86 127.26,70.66 127.26,74.76 127.46,79.16 130.36,87.06 122.66,43.76 131.96,39.16 130.36,39.16 131.96,37.76 130.36,37.76 25.66,55.06 27.06,55.06 28.26,55.06 29.46,55.06 30.66,55.06 28.66,84.56 43.16,84.56 27.96,87.86 52.56,87.76 53.96,84.16 56.46,80.36 52.26,80.26 50.66,82.46 45.66,80.16 38.96,79.86 64.96,71.86 70.56,65.86 74.06,62.56 66.06,66.66 58.16,74.16 58.06,81.96 63.76,76.46 67.66,72.36 71.06,69.06 75.36,64.76 76.86,66.56 71.76,72.66 67.76,76.86 63.46,81.66 59.96,85.36 79.06,62.66 79.16,55.26 68.66,42.86 65.76,43.36
  pour Top (rank 2): 41.96,0.96 158.96,0.96 158.96,98.96 41.96,98.96
  pour Bottom (rank 2): 0.96,98.96 0.96,0.96 158.96,0.96 158.96,98.96
  pour Top (isolate 0.5): 0.96,57.96 0.96,8.96 41.96,8.96 41.96,57.96
  pour Top: 0.96,98.96 0.96,57.96 41.96,57.96 41.96,98.96
  pour Top: 0.96,8.96 0.96,0.96 41.96,0.96 41.96,8.96
IS_SEL  (via drill 0.2)
  Top 0.102: v97.87,19.2 98.51,18.57 98.51,18.31 IC5.2 | v71.78,31.84 71.58,32.03 70.38,32.03 70.31,32.09 IC13.2 | v130.26,52.22 131.72,53.68 131.72,59.46 IC10.2
  Bottom 0.102: v71.78,31.84 84.41,19.2 v97.87,19.2 97.87,19.84 v130.26,52.22
N$1
  Top 0.102: IC4.47 132.48,79.15 138.32,79.15 148.42,89.24 149.44,89.24 149.56,89.37 J1.C1
N$2
  Top 0.406: C1.2 54.85,63.95 C2.2 53.37,65.23 | 53.37,65.23 C3.2 | L1.1 52.95,65.23 53.37,65.23
  Top 0.61: L1.1 51.67,63.95 54.85,63.95
N$3
  Top 0.406: L1.2 53.55,59.13 53.55,58.96 | 53.55,58.96 R1.2 | C2.1 54.75,60.16 53.55,58.96
  Top 0.61: L1.2 53.88,61.08 C2.1
N$4
  Top 0.406: C3.1 50.75,68.17 L2.1
N$5
  Top 0.406: L2.2 46.55,69.57 | C4.1 46.55,69.57 | 46.55,69.57 46.55,69.51 L3.1
  Top 0.61: L3.1 45.36,68.32 L2.2
N$6
  Top 0.406: L3.2 40.95,69.53 | C5.1 40.95,69.53 | 40.95,69.53 40.95,69.23 L4.1
  Top 0.61: L4.1 L3.2
N$7
  Top 0.102: IC4.46 132.48,78.51 140.23,78.51 148.42,86.7 149.44,86.7 149.56,86.83 J1.C2
N$8
  Top 0.102: IC4.44 132.48,77.18 141.43,77.18 148.42,84.16 149.44,84.16 149.56,84.29 J1.C3
N$9
  Top 0.406: L4.2 34.56,68.12 C10.1
N$10
  Top 0.102: IC4.43 132.48,76.61 143.4,76.61 148.42,81.62 149.44,81.62 149.56,81.75 J1.C4
N$11
  Top 0.102: IC4.41 132.48,75.34 144.67,75.34 148.42,79.08 149.44,79.08 149.56,79.21 J1.C5
N$12
  Top 0.102: IC4.40 132.48,74.7 146.58,74.7 148.42,76.54 149.44,76.54 149.56,76.67 J1.C6
N$13
  Top 0.406: C10.2 29.03,68.15 U$2.1
N$14
  Top 0.102: IC4.38 132.48,73.37 147.78,73.37 148.42,74 149.44,74 149.56,74.13 J1.C7
N$15
  Top 0.102: IC4.37 132.48,72.8 148.23,72.8 149.37,71.65 149.56,71.65 J1.C8
N$16
  Top 0.406: C12.1 19.9,69.17 U$3.3
N$17
  Top 0.406: U$2.3 26.31,68.27 C12.2
N$18
  Top 0.406: C13.1 19.87,66.99 U$3.1
N$19
  Top 0.406: C13.2 20.53,64.35 R3.1
N$20
  Top 0.406: U$3.5 13.57,68.55 C15.2
N$21
  Top 0.406: U$2.5 28.26,62.86 C14.1
N$22
  Top 0.61: C14.2 28.17,57.87 U$4.P$3
N$23
  Top 0.406: C15.1 11.04,72.98 X3.1
N$24
  Top 0.102: IC9.2 82,30.82 82,31.84 81.43,32.41 79.27,32.41 77.81,30.95 76.54,30.95 76.47,30.89 IC13.12
N$25
  Top 0.102: IC4.36 132.48,72.16 146.32,72.16 149.37,69.11 149.56,69.11 J1.C9
N$26
  Top 0.102: IC4.35 132.48,71.53 144.42,71.53 149.37,66.57 149.56,66.57 J1.C10
N$27
  Top 0.102: IC4.33 132.48,70.19 135.91,70.19 142,64.1 149.5,64.1 149.56,64.03 J1.C11
N$28
  Top 0.102: IC4.32 132.48,69.62 136.1,69.62 144.16,61.56 149.5,61.56 149.56,61.49 J1.C12
N$29
  Top 0.102: IC4.30 132.48,68.35 136.99,68.35 146.32,59.02 149.5,59.02 149.56,58.95 J1.C13
N$30
  Top 0.102: IC4.29 132.48,67.72 137.24,67.72 148.55,56.41 149.56,56.41 J1.C14
N$31
  Top 0.102: IC4.27 132.48,66.38 136.86,66.38 149.37,53.87 149.56,53.87 J1.C15
N$32
  Top 0.102: IC4.26 132.48,65.81 134.89,65.81 149.37,51.33 149.56,51.33 J1.C16
N$33
  Top 0.102: IC6.4 68.28,61.24 64.79,61.24 U$1.1
N$34  (via drill 0.2)
  Top 0.102: v70.82,59.97 70.25,60.54 70.06,60.54 IC6.2 | v74.95,32.6 75.46,32.09 76.41,32.09 IC13.13 | v100.35,23.08 119.02,23.08 124.48,17.62 125.24,17.62 130.96,23.33 149.56,23.33 J1.C27
  Bottom 0.102: v70.82,59.97 70.82,36.73 v74.95,32.6 84.48,23.08 v100.35,23.08
N$35
  Top 0.102: IC9.4 78.12,29.11 77.81,29.43 76.6,29.43 76.47,29.55 IC13.11
N$36  (via drill 0.2)
  Top 0.102: 132.42,64.48 132.42,65.11 IC4.25 | 132.42,64.48 132.42,61.24 IC10.4 | v132.48,80.42 132.48,79.78 IC4.48 | 132.42,64.48 v132.48,64.48
  Bottom 0.102: v132.48,64.48 v132.48,80.42
N$37
  Top 1.016: U$4.P$7 26.95,49.37 26.96,49.36 | 10.36,34.96 X1.1
  Top 2.1: 26.96,49.36 26.95,33.15 23.96,30.16 19.56,30.16 17.36,32.36 17.36,39.76 15.76,41.36 14.56,41.36 11.76,38.56 11.76,36.36 10.36,34.96
N$38
  Top 1.016: U$4.P$9 29.49,49.23 | 9.76,15.96 9.74,15.98 X2.1
  Top 2.1: 29.49,49.23 30.76,47.96 30.76,28.56 18.18,15.98 9.76,15.96
N$39
  Top 0.61: U$4.P$10 33.59,51.95 R2.2
N$40
  Top 0.102: IC16.3 132.54,44.03 132.54,48.29 R19.2 132.54,48.35 132.35,48.54 131.72,48.54 131.34,48.92 131.34,50.57 130.19,51.71 130,51.71 129.5,52.22 124.61,52.22 120.23,47.84 111.08,47.84 S1.16
N$41
  Top 1.016: U$4.P$6 24.68,51.95 21.32,48.59 R4.1 20.31,48.56 R6.2
N$42
  Top 1.016: R6.1 15.96,48.51 R5.1 13.56,51.76 11.36,53.96 X4.1
N$43  (via drill 0.35)
  Top 0.102: 66.6,72.11 56.83,81.88 16.15,81.88 R8.2 | 66.6,32.06 68.98,29.68 70.19,29.68 70.25,29.62 IC13.4 70.31,29.55 70.31,28.35 IC13.5
  Top 0.152: 66.6,32.06 66.6,39.6 v72.06,45.06 | v75.66,49.46 75.66,63.05 66.6,72.11
  Bottom 0.152: v72.06,45.06 75.66,48.66 v75.66,49.46
N$44  (via drill 0.2, 0.35)
  Top 0.102: v16.21,82.96 R7.2 | 68.85,27.14 68.86,27.14 70.19,27.14 70.25,27.08 IC13.6
  Top 0.152: 68.86,27.14 65.16,30.84 65.16,40.56 v72.56,47.96
  Bottom 0.102: v16.21,82.96 16.41,83.16 33.26,83.16 33.34,83.16
  Bottom 0.152: v72.56,47.96 72.56,51.66 74.36,53.46 74.36,60.16 51.36,83.16 33.26,83.16
N$45
  Top 0.102: R8.1 14.37,81.88 11.26,81.88 10.12,80.73 9.99,80.73 LED3.A
N$46
  Top 0.102: R7.1 12.91,84.35 10.43,81.88 6.24,81.88 5.1,80.73 4.97,80.73 LED2.A
N$64
  Top 0.102: IC16.5 129.94,44.03 129.94,48.29 R20.2 129.94,48.35 129.75,48.54 129.11,48.54 128.73,48.92 128.73,50.83 127.59,51.97 124.73,51.97 118.07,45.3 111.08,45.3 S1.15
N$65
  Top 0.102: IC16.7 127.46,44.03 127.59,44.16 127.59,48.29 R21.2 127.53,48.35 127.27,48.6 126.64,48.6 126.38,48.86 126.38,50.76 125.43,51.71 124.86,51.71 115.91,42.76 111.08,42.76 S1.14
N$66
  Top 0.102: R22.2 125.18,48.29 125.18,45.49 125.05,45.37 125.05,44.16 124.92,44.03 IC16.9 124.86,43.97 124.86,42.7 122.38,40.22 111.08,40.22 S1.13
N$67
  Top 0.102: 124.99,32.35 124.99,33.81 124.92,33.87 IC16.12 | 124.99,32.35 124.99,30.25 R23.2 | 124.99,32.35 123.15,32.35 117.81,37.68 111.08,37.68 S1.12
N$68
  Top 0.102: IC16.14 127.4,33.87 127.34,33.81 127.34,30.25 R24.2 127.34,30.19 127.08,29.93 126.45,29.93 126.13,29.62 126.13,27.71 125.24,26.82 124.67,26.82 116.35,35.14 111.08,35.14 S1.11
N$69
  Top 0.102: IC16.16 129.94,33.87 129.94,30.25 R25.2 129.94,30.19 129.75,30 129.11,30 128.73,29.62 128.73,27.9 127.4,26.57 124.54,26.57 118.51,32.6 111.08,32.6 S1.10
N$70
  Top 0.102: IC16.18 132.54,33.87 132.54,30.25 R26.2 132.54,30.19 132.35,30 131.72,30 131.34,29.62 131.34,27.9 129.75,26.31 124.42,26.31 120.67,30.06 111.08,30.06 S1.9
N$80  (via drill 0.2)
  Top 0.102: v74.38,28.47 74.38,30.51 71.52,33.36 70.31,33.36 IC13.1 | v133.5,32.41 133.75,32.67 133.75,33.87 IC16.19
  Bottom 0.102: v74.38,28.47 74.76,28.47 84.54,18.7 119.78,18.7 v133.5,32.41
N$88
  Top 0.102: R17.1 5.04,86.77 4.97,86.7 LED1.A
N$89  (via drill 0.35)
  Top 0.102: 67.25,38.36 67.25,32.17 69.3,30.13 71.39,30.13 71.52,30 71.52,29.3 71.58,29.24 71.58,28.79 71.52,28.73 71.52,28.09 82.89,16.73 99.46,16.73 100.03,17.3 100.03,19.58 99.65,19.97 99.21,19.97 IC5.4 | v76.66,47.76 76.66,64.75 54.96,86.45 16.47,86.45 16.21,86.7 R17.2
  Top 0.152: 67.25,38.36 67.25,38.96 v73.26,44.96
  Bottom 0.152: v73.26,44.96 76.06,47.76 v76.66,47.76
SOURCE_SEL  (via drill 0.2)
  Top 0.102: IC9.1 82.57,30.76 v82.57,30 82.57,29.93 82.19,29.55 82.19,28.66 78.38,24.85 75.2,24.85 71.84,28.22 71.84,30.51 71.58,30.76 70.38,30.76 70.31,30.82 IC13.3 | v121.5,78.89 121.69,79.08 122.64,79.08 IC4.2
  Bottom 0.102: v121.5,78.89 82.57,39.97 v82.57,30
V1  (via drill 0.2)
  Top 0.102: U$3.6 17.99,67.84 17.99,67.05 19.6,65.43 21.52,65.43 23.32,67.24 28.06,67.24 28.09,67.21 28.4,67.21 28.85,66.76 28.85,66.38 U$2.6 28.91,66.32 29.29,66.32 37.99,57.62 40.28,57.62 v41.68,56.22 | v70.06,59.21 70.06,59.91 IC6.1 | v74.89,29.49 74.89,28.6 75.14,28.35 76.41,28.35 IC13.10 76.47,28.28 76.47,27.08 IC13.9
  Bottom 0.102: 70.06,56.22 70.06,34.32 v74.89,29.49 | 70.06,56.22 v70.06,59.21 | 70.06,56.22 v41.68,56.22
V2  (via drill 0.2)
  Top 0.102: v17.94,70.78 17.94,69.23 U$3.4 | v26.94,66.7 27.07,66.57 27.45,66.57 27.64,66.38 U$2.4 | v72.35,28.47 75.01,25.81 76.41,25.81 IC13.8
  Bottom 0.102: v17.94,70.78 22.87,70.78 v26.94,66.7 65.17,28.47 v72.35,28.47
VCC  (via drill 0.35)
  Top 0.254: 67.9,59.84 67.96,59.91 68.28,59.91 IC6.5 | 63.9,58.83 64.03,58.95 | 63.88,59.1 63.88,59.11 | 63.14,58.83 62.82,58.51 C9.1 62.69,58.51 | 60.6,58.51 C16.1 | 62.44,61.37 U$1.6 | 83.59,29.56 83.39,29.36 | 83.39,29.36 83.2,29.17 82.63,29.17 IC9.5 | 78.25,35.08 77.81,35.52 C11.1 | 76.47,33.43 IC13.14 | 78.12,35.08 C11.1 | 76.98,35.59 77.68,35.59 C11.1 | 121.6,68.99 122.64,68.99 IC4.18 122.77,68.92 123.34,68.92 123.46,68.8 123.59,68.8 123.78,68.99 | 120.18,75.7 119.97,75.91 C17.1 120.54,75.34 121.43,75.34 122,75.91 122.64,75.91 IC4.7 | 131.08,61.81 131.08,61.41 | 131.08,61.41 131.08,61.24 IC10.5 | 130.56,61.94 131.08,61.41 | 130.56,68.86 130.96,69.26 130.96,68.99 130.96,68.67 131.21,68.42 131.59,68.8 131.66,68.8 131.84,68.99 132.42,68.99 IC4.31 | 130.53,74.79 130.56,74.81 130.63,74.89 130.63,75.91 132.42,75.91 IC4.42 | 102.06,30.13 S1.8 102.06,30 | S1.7 102.06,32.73 | S1.6 102.06,35.27 | S1.5 102.06,37.81 | S1.4 102.06,40.35 | 102.06,42.76 S1.3 102.06,42.89 | 102.06,45.3 S1.2 102.06,45.43 | 102.06,47.84 S1.1 102.06,47.91 | 136.1,31.78 136.1,31.2 C18.1 135.97,31.2 135.4,31.2 | 135.08,32.79 135.08,33.87 IC16.20 | 130.83,10.57 C6.1 130.7,10.57 | 133.37,10.57 C8.1 | 97.94,20.22 97.94,20.03 IC5.5 97.81,20.09 97.3,20.09 | 102.45,18.12 102.45,18.19 | 102.89,17.68 102.96,17.68 | 83.46,29.3 83.39,29.36 | U$9.2 128.66,10.76 128.86,10.57
  Top 0.406: 130.93,61.66 131.08,61.81
  Top 0.813: 67.9,59.84 64.62,59.84 63.88,59.11 62.44,60.55 62.44,61.37 | 63.14,58.83 63.9,58.83 | 62.69,58.51 60.6,58.51 | 83.59,29.56 83.59,31.86 80.38,35.08 78.25,35.08 | 78.12,35.08 76.47,33.43 | 63.88,59.1 64.03,58.95 74.89,48.09 74.89,37.67 76.98,35.59 | 121.14,69.45 121.6,68.99 | 120.18,75.7 120.18,70.71 121.3,69.59 121.14,69.45 | 130.56,61.94 130.56,68.86 130.56,74.81 | 130.96,68.99 123.78,68.99 | S1.7 102.06,30.13 | 102.06,32.73 S1.6 | 102.06,35.27 S1.5 | 102.06,37.81 S1.4 | 102.06,40.35 102.06,42.76 | 102.06,42.89 102.06,45.3 | 102.06,45.43 102.06,47.84 | 135.08,32.79 136.1,31.78 | 133.37,10.57 130.83,10.57 | 97.94,20.22 98.7,20.98 99.42,20.98 | 99.42,20.98 99.65,20.98 102.45,18.19 | 102.89,17.68 102.45,18.12 | 128.16,10.57 128.86,10.57 130.7,10.57 | 135.4,31.2 134.21,30.02 134.21,27.42 132.36,25.56 131.86,25.56 131.36,25.06 125.45,19.16 v125.41,19.16 | 102.06,30 102.06,26.02 99.42,23.37 99.42,20.98 | 121.14,69.45 102.76,51.06 102.76,48.6 102.06,47.91 | 83.46,29.3 88.09,29.3 95.24,22.15 | 97.3,20.09 95.24,22.15 | v123.06,16.86 123.06,16.76 122.96,16.66 | C20.1 94.16,21.06 95.24,22.15 | C19.1 130.93,61.66 | 130.53,74.79 130.53,82.49 C21.1
  Top 2.54: 119.96,12.96 119.96,8.96 122.96,8.96 122.96,11.96 120.96,11.96
  Bottom 0.813: v125.41,19.16 123.11,16.86 v123.06,16.86
  pour Top: 124.96,17.96 102.96,17.96 102.96,3.96 124.96,3.96
WE  (via drill 0.2)
  Top 0.102: v131.15,53.87 131.15,59.46 IC10.1
  Bottom 0.102: v131.15,53.87 131.15,35.52 148.29,18.38 148.29,17.23 149.56,15.96 149.56,15.77 J1.C30

### Text on the board
tPlace: RF Generation Board V1.0 / by SOR @ DKFZ | RF Ext In | 1 | RF Out -10 dB | Address | RF out 1 | RF out 2